# Altium schematic sheet Sheet1.SchDoc
size A4
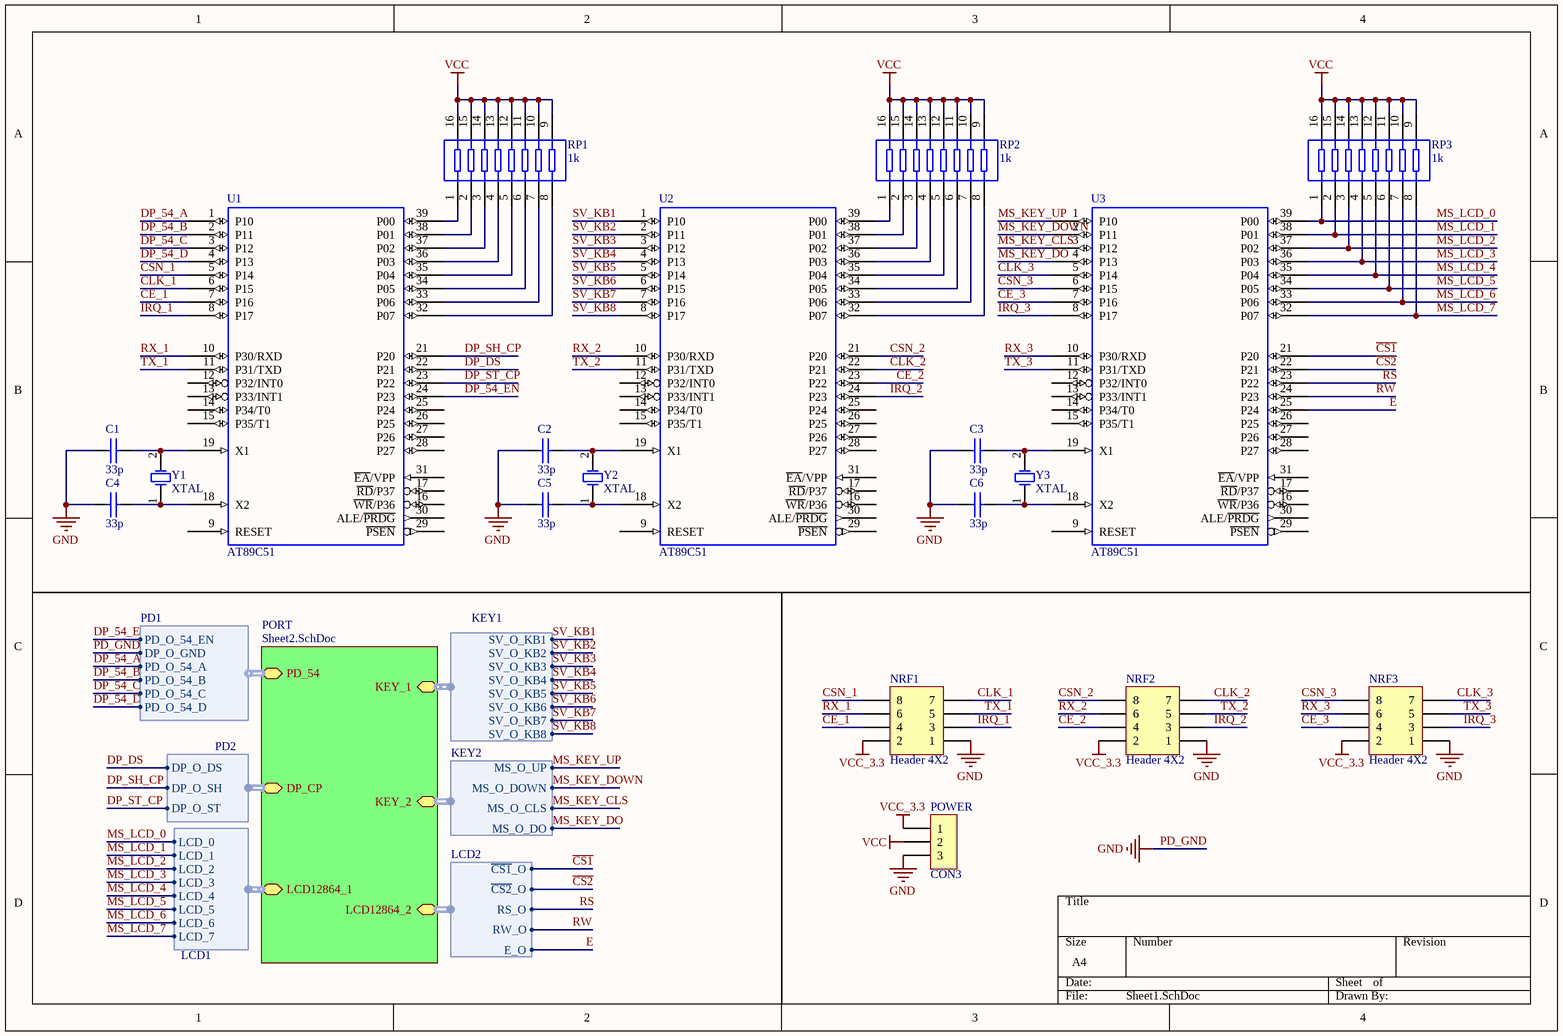
[diagram p0: Sheet1.SchDoc]

## Parts
C1  33p  [RAD0.1]
C2  33p  [RAD0.1]
C3  33p  [RAD0.1]
C4  33p  [RAD0.1]
C5  33p  [RAD0.1]
C6  33p  [RAD0.1]
NRF1  Header 4X2  [HDR2X4]
NRF2  Header 4X2  [HDR2X4]
NRF3  Header 4X2  [HDR2X4]
POWER  CON3
RP1  1k  [DIP16]
RP2  1k  [DIP16]
RP3  1k  [DIP16]
U1  AT89C51  [DIP-40]
U2  AT89C51  [DIP-40]
U3  AT89C51  [DIP-40]
Y1  XTAL  [XTAL]
Y2  XTAL  [XTAL]
Y3  XTAL  [XTAL]

## Sub-sheets
PORT = Sheet2.SchDoc: PD_54 (harness PD1), KEY_1 (harness KEY1), KEY_2 (harness KEY2), DP_CP (harness PD2), LCD12864_1 (harness LCD1), LCD12864_2 (harness LCD2)

## Harnesses
PD1: DP_O_GND, PD_O_54_EN, PD_O_54_A, PD_O_54_B, PD_O_54_C, PD_O_54_D
KEY1: SV_O_KB1, SV_O_KB2, SV_O_KB3, SV_O_KB4, SV_O_KB5, SV_O_KB6, SV_O_KB7, SV_O_KB8
KEY2: MS_O_UP, MS_O_DOWN, MS_O_CLS, MS_O_DO
PD2: DP_O_SH, DP_O_ST, DP_O_DS
LCD1: LCD_0, LCD_1, LCD_2, LCD_3, LCD_4, LCD_5, LCD_6, LCD_7
LCD2: ~{CS1}_O, ~{CS2}_O, RS_O, RW_O, E_O

## Nets
PD_GND: C1.1 C2.1 C3.1 C4.1 C5.1 C6.1 NRF1.1 NRF2.1 NRF3.1 POWER.3 U1.20(GND) U2.20(GND) U3.20(GND) ; sheet PORT/PD_54.DP_O_GND  [also labelled GND]
VCC: POWER.2 RP1.9 RP1.10 RP1.11 RP1.12 RP1.13 RP1.14 RP1.15 RP1.16 RP2.9 RP2.10 RP2.11 RP2.12 RP2.13 RP2.14 RP2.15 RP2.16 RP3.9 RP3.10 RP3.11 RP3.12 RP3.13 RP3.14 RP3.15 RP3.16 U1.40(VCC) U2.40(VCC) U3.40(VCC)
VCC_3.3: NRF1.2 NRF2.2 NRF3.2 POWER.1
~{CS1}: U3.21(P20) ; sheet PORT/LCD12864_2.~{CS1}_O
~{CS2}: U3.22(P21) ; sheet PORT/LCD12864_2.~{CS2}_O
CE_1: NRF1.4 U1.7(P16)
CE_2: NRF2.4 U2.23(P22)
CE_3: NRF3.4 U3.7(P16)
CLK_1: NRF1.7 U1.6(P15)
CLK_2: NRF2.7 U2.22(P21)
CLK_3: NRF3.7 U3.5(P14)
CSN_1: NRF1.8 U1.5(P14)
CSN_2: NRF2.8 U2.21(P20)
CSN_3: NRF3.8 U3.6(P15)
DP_54_A: U1.1(P10) ; sheet PORT/PD_54.PD_O_54_A
DP_54_B: U1.2(P11) ; sheet PORT/PD_54.PD_O_54_B
DP_54_C: U1.3(P12) ; sheet PORT/PD_54.PD_O_54_C
DP_54_D: U1.4(P13) ; sheet PORT/PD_54.PD_O_54_D
DP_54_EN: U1.24(P23) ; sheet PORT/PD_54.PD_O_54_EN
DP_DS: U1.22(P21) ; sheet PORT/DP_CP.DP_O_DS
DP_SH_CP: U1.21(P20) ; sheet PORT/DP_CP.DP_O_SH
DP_ST_CP: U1.23(P22) ; sheet PORT/DP_CP.DP_O_ST
E: U3.25(P24) ; sheet PORT/LCD12864_2.E_O
IRQ_1: NRF1.3 U1.8(P17)
IRQ_2: NRF2.3 U2.24(P23)
IRQ_3: NRF3.3 U3.8(P17)
MS_KEY_CLS: U3.3(P12) ; sheet PORT/KEY_2.MS_O_CLS
MS_KEY_DO: U3.4(P13) ; sheet PORT/KEY_2.MS_O_DO
MS_KEY_DOWN: U3.2(P11) ; sheet PORT/KEY_2.MS_O_DOWN
MS_KEY_UP: U3.1(P10) ; sheet PORT/KEY_2.MS_O_UP
MS_LCD_0: RP3.1 U3.39(P00) ; sheet PORT/LCD12864_1.LCD_0
MS_LCD_1: RP3.2 U3.38(P01) ; sheet PORT/LCD12864_1.LCD_1
MS_LCD_2: RP3.3 U3.37(P02) ; sheet PORT/LCD12864_1.LCD_2
MS_LCD_3: RP3.4 U3.36(P03) ; sheet PORT/LCD12864_1.LCD_3
MS_LCD_4: RP3.5 U3.35(P04) ; sheet PORT/LCD12864_1.LCD_4
MS_LCD_5: RP3.6 U3.34(P05) ; sheet PORT/LCD12864_1.LCD_5
MS_LCD_6: RP3.7 U3.33(P06) ; sheet PORT/LCD12864_1.LCD_6
MS_LCD_7: RP3.8 U3.32(P07) ; sheet PORT/LCD12864_1.LCD_7
RS: U3.23(P22) ; sheet PORT/LCD12864_2.RS_O
RW: U3.24(P23) ; sheet PORT/LCD12864_2.RW_O
RX_1: NRF1.6 U1.10(P30/RXD)
RX_2: NRF2.6 U2.10(P30/RXD)
RX_3: NRF3.6 U3.10(P30/RXD)
SV_KB1: U2.1(P10) ; sheet PORT/KEY_1.SV_O_KB1
SV_KB2: U2.2(P11) ; sheet PORT/KEY_1.SV_O_KB2
SV_KB3: U2.3(P12) ; sheet PORT/KEY_1.SV_O_KB3
SV_KB4: U2.4(P13) ; sheet PORT/KEY_1.SV_O_KB4
SV_KB5: U2.5(P14) ; sheet PORT/KEY_1.SV_O_KB5
SV_KB6: U2.6(P15) ; sheet PORT/KEY_1.SV_O_KB6
SV_KB7: U2.7(P16) ; sheet PORT/KEY_1.SV_O_KB7
SV_KB8: U2.8(P17) ; sheet PORT/KEY_1.SV_O_KB8
TX_1: NRF1.5 U1.11(P31/TXD)
TX_2: NRF2.5 U2.11(P31/TXD)
TX_3: NRF3.5 U3.11(P31/TXD)
NetC1_2: C1.2 U1.19(X1) Y1.2
NetC2_2: C2.2 U2.19(X1) Y2.2
NetC3_2: C3.2 U3.19(X1) Y3.2
NetC4_2: C4.2 U1.18(X2) Y1.1
NetC5_2: C5.2 U2.18(X2) Y2.1
NetC6_2: C6.2 U3.18(X2) Y3.1
NetRP1_1: RP1.1 U1.39(P00)
NetRP1_2: RP1.2 U1.38(P01)
NetRP1_3: RP1.3 U1.37(P02)
NetRP1_4: RP1.4 U1.36(P03)
NetRP1_5: RP1.5 U1.35(P04)
NetRP1_6: RP1.6 U1.34(P05)
NetRP1_7: RP1.7 U1.33(P06)
NetRP1_8: RP1.8 U1.32(P07)
NetRP2_1: RP2.1 U2.39(P00)
NetRP2_2: RP2.2 U2.38(P01)
NetRP2_3: RP2.3 U2.37(P02)
NetRP2_4: RP2.4 U2.36(P03)
NetRP2_5: RP2.5 U2.35(P04)
NetRP2_6: RP2.6 U2.34(P05)
NetRP2_7: RP2.7 U2.33(P06)
NetRP2_8: RP2.8 U2.32(P07)

Not connected (* = marked no-connect by the designer): U1 9(RESET) 12(P32/INT0) 13(P33/INT1) 14(P34/T0) 15(P35/T1) 16(~{WR}/P36) 17(~{RD}/P37) 25(P24) 26(P25) 27(P26) 28(P27) 29(~{PSEN}) 30(ALE/~{PRDG}) 31(~{EA}/VPP); U2 9(RESET) 12(P32/INT0) 13(P33/INT1) 14(P34/T0) 15(P35/T1) 16(~{WR}/P36) 17(~{RD}/P37) 25(P24) 26(P25) 27(P26) 28(P27) 29(~{PSEN}) 30(ALE/~{PRDG}) 31(~{EA}/VPP); U3 9(RESET) 12(P32/INT0) 13(P33/INT1) 14(P34/T0) 15(P35/T1) 16(~{WR}/P36) 17(~{RD}/P37) 26(P25) 27(P26) 28(P27) 29(~{PSEN}) 30(ALE/~{PRDG}) 31(~{EA}/VPP)

## Library data of the parts
C1-C6 = 普通电容: Capacitor
NRF1-NRF3 = Header 4X2: Header, 4-Pin, Dual row; LatestRevisionDate: 17-Jul-2002; LatestRevisionNote: Re-released for DXP Platform.; Publisher: Altium Limited
POWER = CON3: Connector
RP1-RP3 = RESPACK4
Y1-Y3 = XTAL: XTAL: 12MHZ